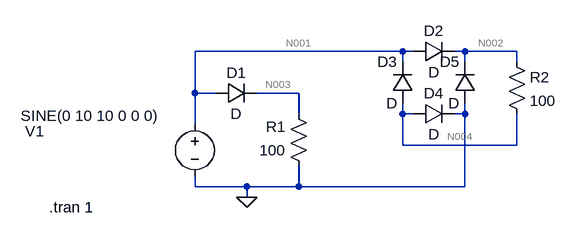
[diagram p0: schematic diode_redressement.asc]
diode_redressement.asc, the LTspice schematic file:
Version 4
SHEET 1 880 680
WIRE 432 16 112 16
WIRE 448 16 432 16
WIRE 528 16 512 16
WIRE 608 16 528 16
WIRE 432 32 432 16
WIRE 528 32 528 16
WIRE 608 32 608 16
WIRE 112 80 112 16
WIRE 144 80 112 80
WIRE 272 80 208 80
WIRE 272 112 272 80
WIRE 432 112 432 96
WIRE 448 112 432 112
WIRE 528 112 528 96
WIRE 528 112 512 112
WIRE 112 128 112 80
WIRE 432 160 432 112
WIRE 608 160 608 112
WIRE 608 160 432 160
WIRE 112 224 112 208
WIRE 192 224 112 224
WIRE 272 224 272 192
WIRE 272 224 192 224
WIRE 528 224 528 112
WIRE 528 224 272 224
WIRE 192 240 192 224
FLAG 192 240 0
SYMBOL diode 144 96 R270
WINDOW 0 32 32 VTop 2
WINDOW 3 0 32 VBottom 2
SYMATTR InstName D1
SYMBOL voltage 112 112 R0
WINDOW 0 -261 27 Left 2
WINDOW 3 -268 3 Left 2
WINDOW 123 0 0 Left 0
WINDOW 39 0 0 Left 0
SYMATTR InstName V1
SYMATTR Value SINE(0 10 10 0 0 0)
SYMBOL res 288 208 R180
WINDOW 0 36 76 Left 2
WINDOW 3 36 40 Left 2
SYMATTR InstName R1
SYMATTR Value 100
SYMBOL diode 448 32 R270
WINDOW 0 32 32 VTop 2
WINDOW 3 0 32 VBottom 2
SYMATTR InstName D2
SYMBOL diode 448 96 R180
WINDOW 0 24 64 Left 2
WINDOW 3 24 0 Left 2
SYMATTR InstName D3
SYMBOL diode 448 128 R270
WINDOW 0 32 32 VTop 2
WINDOW 3 0 32 VBottom 2
SYMATTR InstName D4
SYMBOL diode 544 96 R180
WINDOW 0 24 64 Left 2
WINDOW 3 24 0 Left 2
SYMATTR InstName D5
SYMBOL res 592 16 R0
SYMATTR InstName R2
SYMATTR Value 100
TEXT -112 256 Left 2 !.tran 1

The netlist it stands for:
* diode_redressement.asc
D1 N001 N003 D
V1 N001 0 SINE(0 10 10 0 0 0)
R1 0 N003 100
D2 N001 N002 D
D3 N004 N001 D
D4 N004 0 D
D5 0 N002 D
R2 N002 N004 100
.model D D
.lib standard.dio
.tran 1
.backanno
.end

* Results of the author's LTspice run, read from the files saved beside the schematic
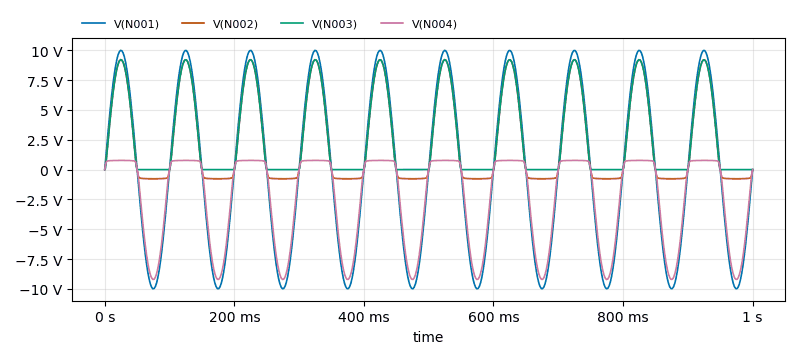
[diagram p1: Transient Analysis of diode_redressement.asc, plotted from the saved traces]
* Transient Analysis, 1 run:
*   V(N001): min -9.995 V, max 9.995 V, average 0 V, rms 7.069 V, last 0 V
*   V(N002): min -769.9 mV, max 9.216 V, average 2.464 V, rms 4.545 V, last 0 V
*   V(N003): min 0 V, max 9.213 V, average 2.812 V, rms 4.513 V, last 0 V
*   V(N004): min -9.216 V, max 769.9 mV, average -2.464 V, rms 4.545 V, last 0 V